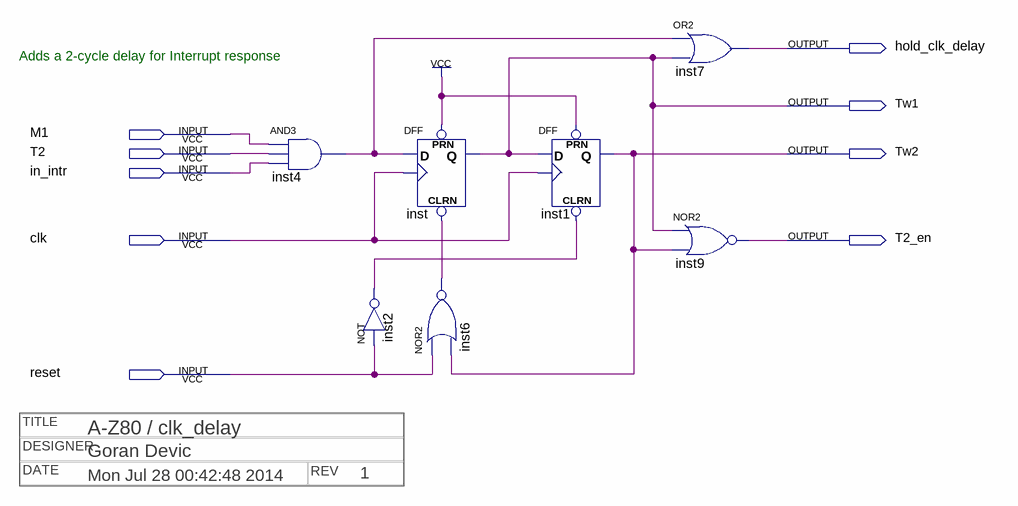
[diagram p0: schematic sheet]
// Quartus schematic clk_delay.bdf as structural Verilog: 7 symbols, 9 pins
// Title block: DATE: Mon Jul 28 00:42:48 2014; DESIGNER: Goran Devic; REV: 1; TITLE: A-Z80 / clk_delay
module clk_delay (
  input  M1,
  input  T2,
  input  in_intr,
  input  clk,
  input  reset,
  output hold_clk_delay,
  output Tw1,
  output Tw2,
  output T2_en
);

  wire inst2_out, inst4_out, inst6_out;

  and inst4 (inst4_out, M1, T2, in_intr);
  DFF inst (.CLRN(inst6_out), .CLK(clk), .D(inst4_out), .PRN(1'b1), .Q(Tw1));
  nor inst6 (inst6_out, reset, Tw2);
  not inst2 (inst2_out, reset);
  DFF inst1 (.CLRN(inst2_out), .CLK(clk), .D(Tw1), .PRN(1'b1), .Q(Tw2));
  or inst7 (hold_clk_delay, inst4_out, Tw1);
  nor inst9 (T2_en, Tw1, Tw2);

  // Notes on the sheet:
  //   Adds a 2-cycle delay for Interrupt response
endmodule
